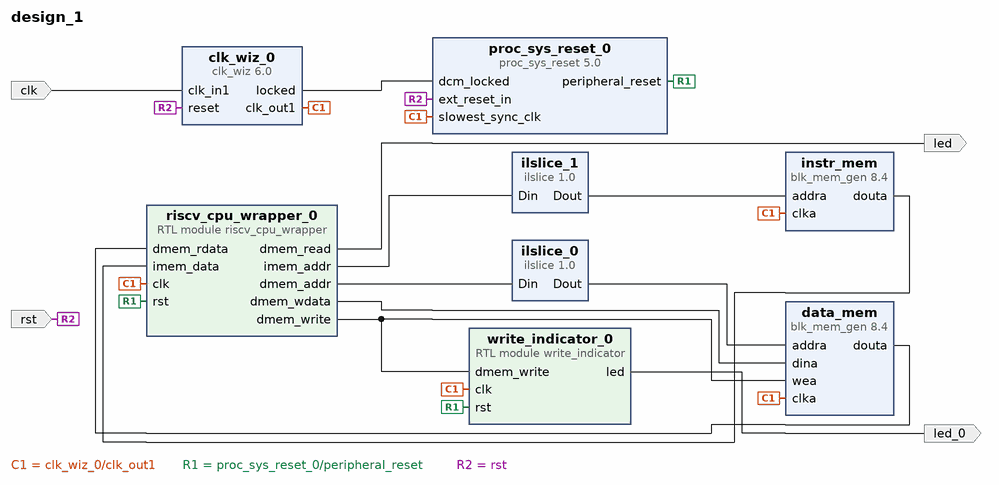
[diagram p0: block diagram of the top level]
# Vivado block design design_1, xc7a35tcpg236-1, Vivado 2025.1
create_bd_design design_1

create_bd_port -dir I -type clk clk
create_bd_port -dir I -type rst rst
set_property -dict {CONFIG.POLARITY ACTIVE_HIGH} [get_bd_ports rst]
create_bd_port -dir O led
create_bd_port -dir O led_0

create_bd_cell -type module -reference riscv_cpu_wrapper riscv_cpu_wrapper_0
create_bd_cell -type ip -vlnv xilinx.com:ip:clk_wiz:6.0 clk_wiz_0
set_property -dict [list \
  CONFIG.CLKOUT1_JITTER 137.143 \
  CONFIG.CLKOUT1_REQUESTED_OUT_FREQ 80.000 \
  CONFIG.MMCM_CLKOUT0_DIVIDE_F 12.500 \
] [get_bd_cells clk_wiz_0]
create_bd_cell -type ip -vlnv xilinx.com:ip:proc_sys_reset:5.0 proc_sys_reset_0
create_bd_cell -type ip -vlnv xilinx.com:ip:blk_mem_gen:8.4 data_mem
set_property -dict [list \
  CONFIG.Enable_A Always_Enabled \
  CONFIG.Operating_Mode_A READ_FIRST \
  CONFIG.use_bram_block Stand_Alone \
] [get_bd_cells data_mem]
create_bd_cell -type ip -vlnv xilinx.com:ip:blk_mem_gen:8.4 instr_mem
set_property -dict [list \
  CONFIG.Coe_File ../../../../../../imem_init.coe \
  CONFIG.Enable_A Always_Enabled \
  CONFIG.Load_Init_File true \
  CONFIG.Operating_Mode_A READ_FIRST \
  CONFIG.use_bram_block Stand_Alone \
] [get_bd_cells instr_mem]
create_bd_cell -type inline_hdl -vlnv xilinx.com:inline_hdl:ilslice:1.0 ilslice_0
set_property -dict {CONFIG.DIN_FROM 14 CONFIG.DIN_TO 2} [get_bd_cells ilslice_0]
create_bd_cell -type inline_hdl -vlnv xilinx.com:inline_hdl:ilslice:1.0 ilslice_1
set_property -dict {CONFIG.DIN_FROM 14 CONFIG.DIN_TO 2} [get_bd_cells ilslice_1]
create_bd_cell -type module -reference write_indicator write_indicator_0

# ---- connections ----

connect_bd_net [get_bd_ports clk] [get_bd_pins clk_wiz_0/clk_in1]
connect_bd_net [get_bd_pins clk_wiz_0/clk_out1] \
  [get_bd_pins riscv_cpu_wrapper_0/clk] [get_bd_pins proc_sys_reset_0/slowest_sync_clk] [get_bd_pins instr_mem/clka] \
  [get_bd_pins data_mem/clka] [get_bd_pins write_indicator_0/clk]
connect_bd_net [get_bd_pins clk_wiz_0/locked] [get_bd_pins proc_sys_reset_0/dcm_locked]
connect_bd_net [get_bd_pins data_mem/douta] [get_bd_pins riscv_cpu_wrapper_0/dmem_rdata]
connect_bd_net [get_bd_pins ilslice_0/Dout] [get_bd_pins data_mem/addra]
connect_bd_net [get_bd_pins ilslice_1/Dout] [get_bd_pins instr_mem/addra]
connect_bd_net [get_bd_pins instr_mem/douta] [get_bd_pins riscv_cpu_wrapper_0/imem_data]
connect_bd_net [get_bd_pins proc_sys_reset_0/peripheral_reset] [get_bd_pins riscv_cpu_wrapper_0/rst] [get_bd_pins write_indicator_0/rst]
connect_bd_net [get_bd_pins riscv_cpu_wrapper_0/dmem_addr] [get_bd_pins ilslice_0/Din]
connect_bd_net [get_bd_pins riscv_cpu_wrapper_0/dmem_read] [get_bd_ports led]
connect_bd_net [get_bd_pins riscv_cpu_wrapper_0/dmem_wdata] [get_bd_pins data_mem/dina]
connect_bd_net [get_bd_pins riscv_cpu_wrapper_0/dmem_write] [get_bd_pins data_mem/wea] [get_bd_pins write_indicator_0/dmem_write]
connect_bd_net [get_bd_pins riscv_cpu_wrapper_0/imem_addr] [get_bd_pins ilslice_1/Din]
connect_bd_net [get_bd_ports rst] [get_bd_pins clk_wiz_0/reset] [get_bd_pins proc_sys_reset_0/ext_reset_in]
connect_bd_net [get_bd_pins write_indicator_0/led] [get_bd_ports led_0]

validate_bd_design
save_bd_design
